# EAGLE design shield-st7735_1.8-spi-UNO-r4 (EAGLE 9.6.2)
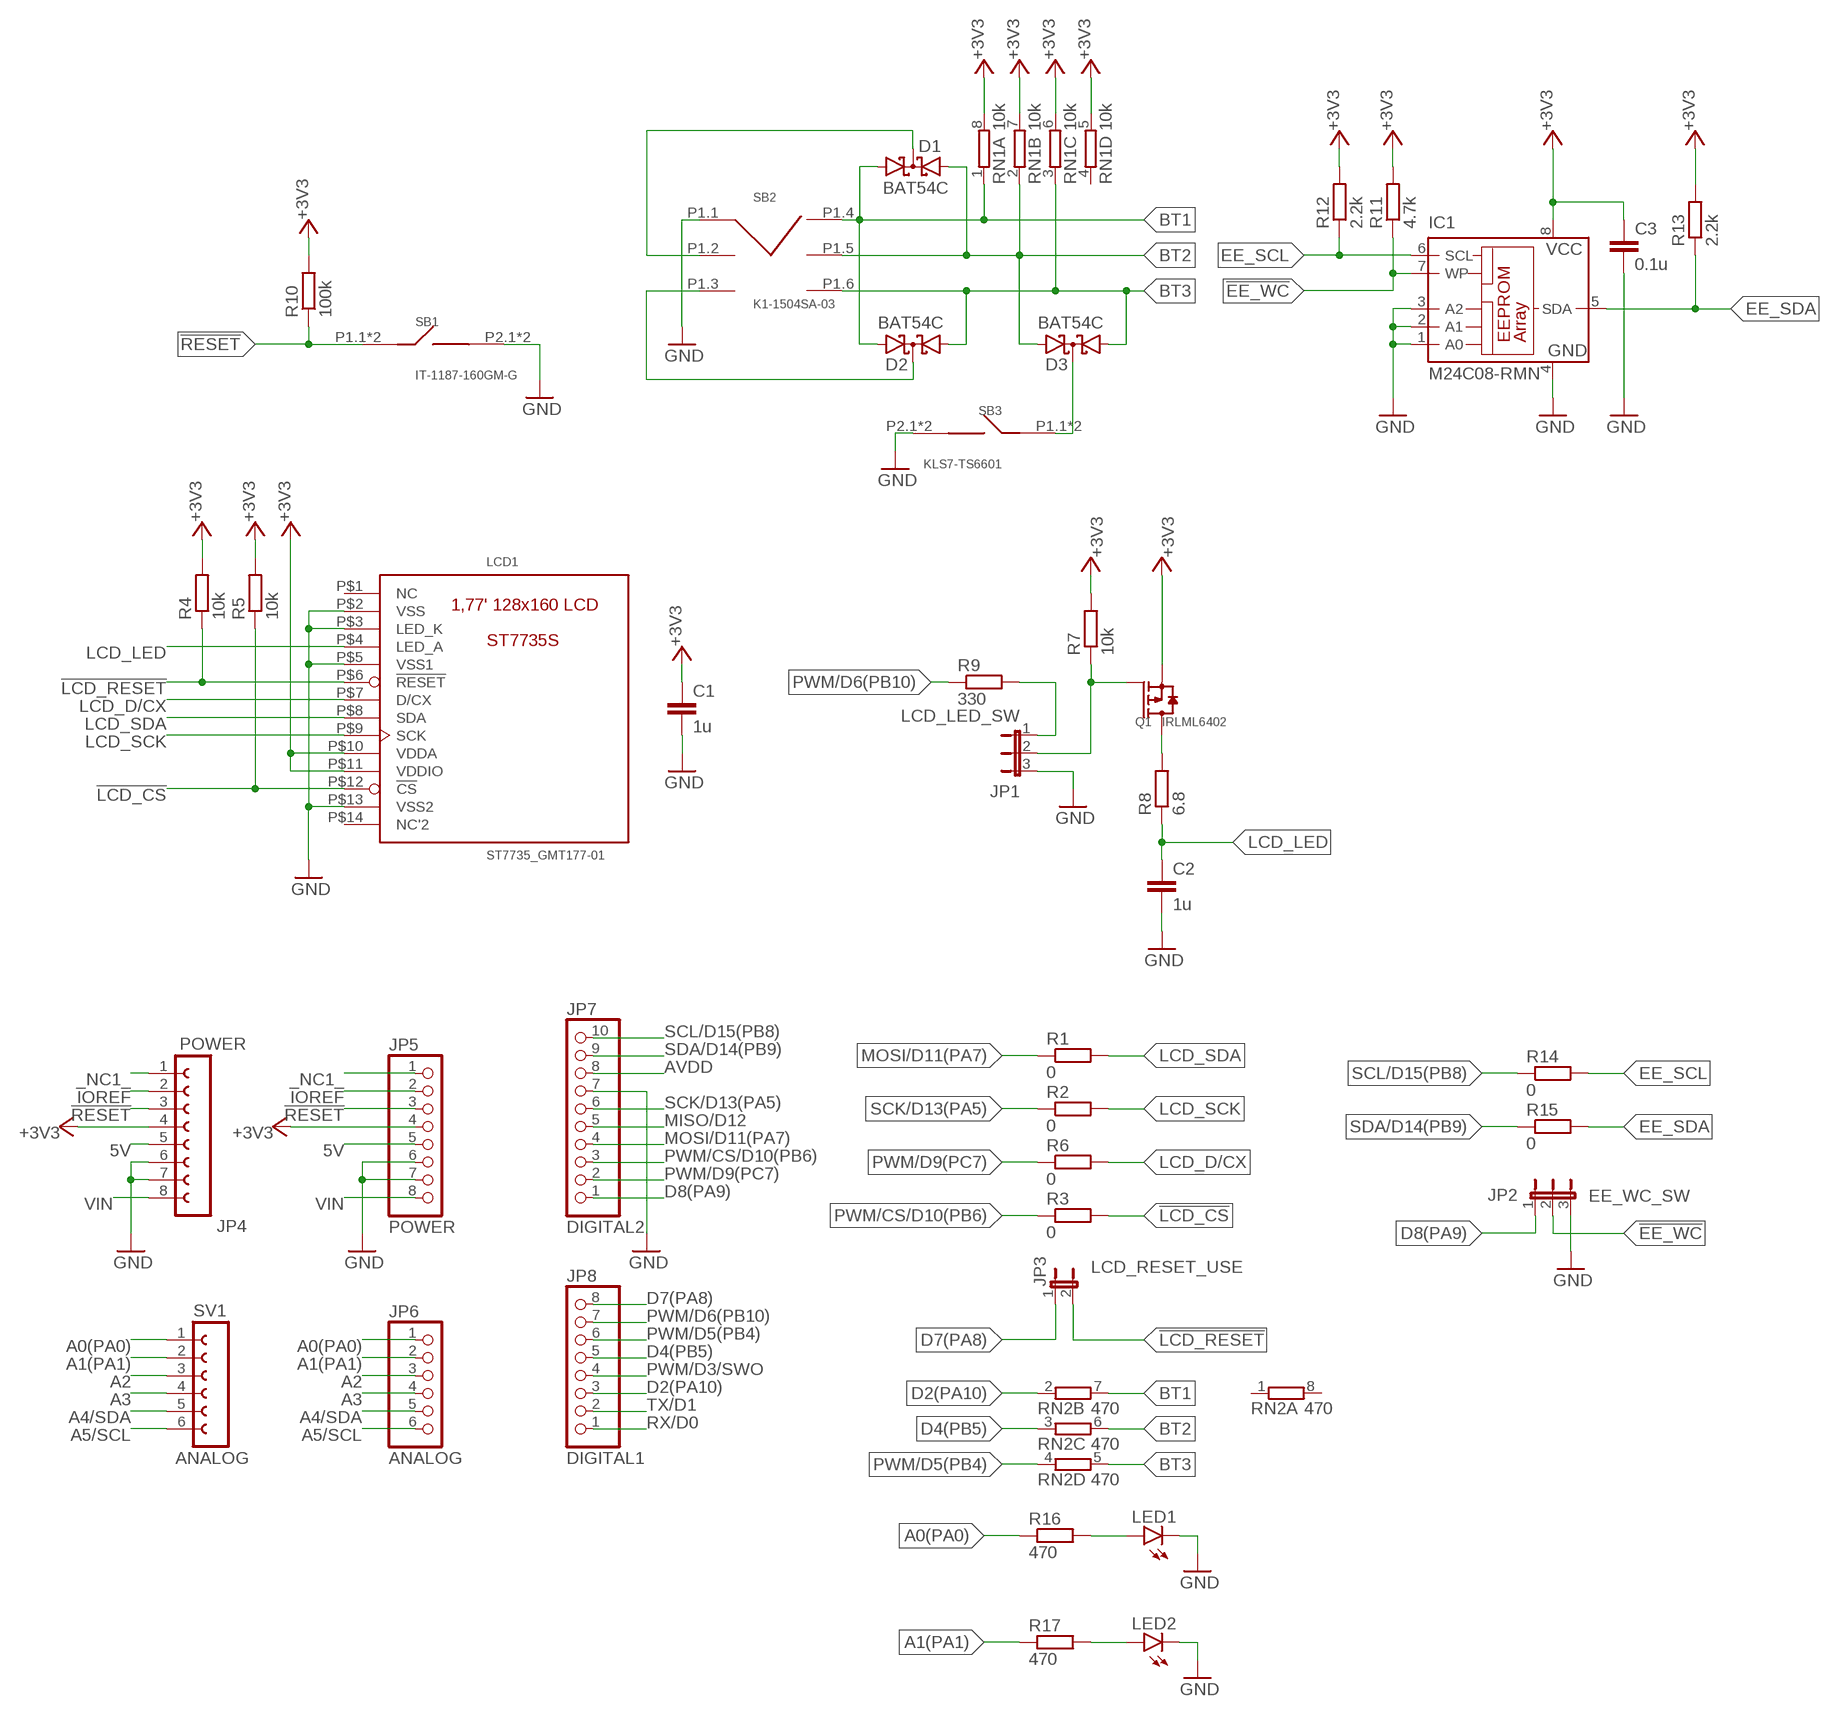
[diagram p0: schematic, sheet 1]

## Parts
C1  1u  C-EUC1206  [C1206]
C2  1u  C-EUC1206  [C1206]
C3  0.1u  C-EUC1206  [C1206]
D1  BAT54C  [SOT23]
D2  BAT54C  [SOT23]
D3  BAT54C  [SOT23]
IC1  M24C08-RMN  24LC08BSN  [SO-08]
JP1  LCD_LED_SW  JP2E  [JP2]
JP2  EE_WC_SW  JP2E  [JP2]
JP3  LCD_RESET_USE  JP1E  [JP1]
JP4  POWER  FE08-1  [FE08]
JP5  POWER  PINHD-1X8  [1X08]
JP6  ANALOG  PINHD-1X6  [1X06]
JP7  DIGITAL2  PINHD-1X10  [1X10]
JP8  DIGITAL1  PINHD-1X8  [1X08]
LCD1  ST7735_GMT177-01  [GMT177-01]
LED1  LEDCHIP-LED0805  [CHIP-LED0805]
LED2  LEDCHIP-LED0805  [CHIP-LED0805]
Q1  IRLML6402  [SOT23]
R1  0  R-EU_R1206  [R1206]
R2  0  R-EU_R1206  [R1206]
R3  0  R-EU_R1206  [R1206]
R4  10k  R-EU_R1206  [R1206]
R5  10k  R-EU_R1206  [R1206]
R6  0  R-EU_R1206  [R1206]
R7  10k  R-EU_R1206  [R1206]
R8  6.8  R-EU_R1206  [R1206]
R9  330  R-EU_R1206  [R1206]
R10  100k  R-EU_R1206  [R1206]
R11  4.7k  R-EU_R1206  [R1206]
R12  2.2k  R-EU_R1206  [R1206]
R13  2.2k  R-EU_R1206  [R1206]
R14  0  R-EU_R1206  [R1206]
R15  0  R-EU_R1206  [R1206]
R16  470  R-EU_R1206  [R1206]
R17  470  R-EU_R1206  [R1206]
RN1  10k  4R-NEXB38V  [EXB38V]
RN2  470  4R-NEXB38V  [EXB38V]
SB1  IT-1187-160GM-G  [IT-1187-160GM-G]
SB2  K1-1504SA-03  [K1-1504SA-3]
SB3  KLS7-TS6601  [KLS7-TS6601]
SV1  ANALOG  FE06-1  [FE06]

## Nets
5V [VDD]: JP4.5 JP5.5
!EE_WC!: IC1.7(WP) JP2.2 R11.1
!LCD_CS!: LCD1.P$12(!CS!) R3.2 R5.1
!LCD_RESET!: JP3.2 LCD1.P$6(!RESET!) R4.1
!RESET!: JP4.3 JP5.3 R10.1 SB1.P1.1(P1) SB1.P1.2(P1)
+3V3 [VDD]: C1.1 C3.1 IC1.8(VCC) JP4.4 JP5.4 LCD1.P$10(VDDA) LCD1.P$11(VDDIO) Q1.2(S) R4.2 R5.2 R7.2 R10.2 R11.2 R12.2 R13.2 RN1.5 RN1.6 RN1.7 RN1.8
_NC1_: JP4.1 JP5.1
A0(PA0): JP6.1 R16.1 SV1.1
A1(PA1): JP6.2 R17.1 SV1.2
A2: JP6.3 SV1.3
A3: JP6.4 SV1.4
A4/SDA: JP6.5 SV1.5
A5/SCL: JP6.6 SV1.6
AVDD: JP7.8
BT1: D1.1(A1) D2.2(A2) RN1.1 RN2.7 SB2.P1.4(P4)
BT2: D1.2(A2) D3.2(A2) RN1.2 RN2.6 SB2.P1.5(P5)
BT3: D2.1(A1) D3.1(A1) RN1.3 RN2.5 SB2.P1.6(P6)
D2(PA10): JP8.3 RN2.2
D4(PB5): JP8.5 RN2.3
D7(PA8): JP3.1 JP8.8
D8(PA9): JP2.1 JP7.1
EE_SCL: IC1.6(SCL) R12.1 R14.2
EE_SDA: IC1.5(SDA) R13.1 R15.2
GND [GND]: C1.2 C2.2 C3.2 IC1.1(A0) IC1.2(A1) IC1.3(A2) IC1.4(GND) JP1.3 JP2.3 JP4.6 JP4.7 JP5.6 JP5.7 JP7.7 LCD1.P$2(VSS) LCD1.P$3(LED_K) LCD1.P$5(VSS1) LCD1.P$13(VSS2) LED1.C LED2.C SB1.P2.1(P2) SB1.P2.2(P2) SB2.P1.1(P1) SB3.P2.1(P2) SB3.P2.2(P2)
IOREF: JP4.2 JP5.2
LCD_D/CX: LCD1.P$7(D/CX) R6.2
LCD_LED: C2.1 LCD1.P$4(LED_A) R8.1
LCD_SCK: LCD1.P$9(SCK) R2.2
LCD_SDA: LCD1.P$8(SDA) R1.2
MISO/D12: JP7.5
MOSI/D11(PA7): JP7.4 R1.1
N$1: JP1.2 Q1.1(G) R7.1
N$2: Q1.3(D) R8.2
N$3: D2.3(CC) SB2.P1.3(P3)
N$4: JP1.1 R9.2
N$5: D1.3(CC) SB2.P1.2(P2)
N$6: D3.3(CC) SB3.P1.1(P1) SB3.P1.2(P1)
N$7: LED2.A R17.2
N$8: LED1.A R16.2
PWM/CS/D10(PB6): JP7.3 R3.1
PWM/D3/SWO: JP8.4
PWM/D5(PB4): JP8.6 RN2.4
PWM/D6(PB10): JP8.7 R9.1
PWM/D9(PC7): JP7.2 R6.1
RX/D0: JP8.1
SCK/D13(PA5): JP7.6 R2.1
SCL/D15(PB8): JP7.10 R14.1
SDA/D14(PB9): JP7.9 R15.1
TX/D1: JP8.2
VIN [VDD]: JP4.8 JP5.8
Unconnected: LCD1.P$1(NC) LCD1.P$14(NC'2) RN1.4 RN2.1 RN2.8

## Library data of the parts
C1-C3 = rcl:C-EU: CAPACITOR, European symbol; SPICEPREFIX: C
D1-D3 = diode:BAT54C: Schottky Diodes Source: Fairchild .. BAT54.pdf
IC1 = microchip:24*: Serial EEPROM I2C; MPN: 24LC08B/SN; OC_FARNELL: 1212669; OC_NEWARK: 12C2005
JP1 JP2 = jumper:JP2E: JUMPER
JP3 = jumper:JP1E: JUMPER
JP4 = con-lsta:FE08-1: FEMALE HEADER; OC_FARNELL: unknown; OC_NEWARK: unknown
JP5 JP8 = pinhead:PINHD-1X8: PIN HEADER
JP6 = pinhead:PINHD-1X6: PIN HEADER
JP7 = pinhead:PINHD-1X10: PIN HEADER
LCD1 = other_lcd:ST7735_GMT177-01: 1,77'' LCD Module Resolution: 128x160 Color: RGB (565) Controller: ST7735S
LED1 LED2 = led:LED: LED OSRAM: - CHIPLED LG R971, LG N971, LY N971, LG Q971, LY Q971, LO R971, LY R971 LH N974, LH R974 LS Q976, LO Q976, LY Q976 LO Q996 - Hyper CHIPLED LW Q18S LB Q993, LB Q99A, LB R99A - SideLED LS A670, LO A670, LY A670, LG A670, LP A670 LB A673, LV A673, LT A673, LW A673 LH A674 LY A675 LS A676, LA A676, LO A676, LY A676, LW A676 LS A679, LY A679, LG A679 - Hyper Micro SIDELED® LS Y876, LA Y876, LO Y876, LY Y876 LT Y87S - SmartLED LW L88C, LW L88S LB L89C, LB L89S, LG L890 LS L89K, LO L89K, LY L89K LS L896, LA L896, LO L896, LY L896 - TOPLED LS T670, LO T670, LY T670, LG T670, LP T670 LSG T670, LSP T670, LSY T670, LOP T670, LYG T670 LG T671, LOG T671, LSG T671 LB T673, LV T673, LT T673, LW T673 LH T674 LS T676, LA T676, LO T676, LY T676, LB T676, LH T676, LSB T676, LW T676 LB T67C, LV T67C, LT T67C, LS T67K, LO T67K, LY T67K, LW E67C LS E67B, LA E67B, LO E67B, LY E67B, LB E67C, LV E67C, LT E67C LW T67C LS T679, LY T679, LG T679 LS T770, LO T770, LY T770, LG T770, LP T770 LB T773, LV T773, LT T773, LW T773 LH T774 LS E675, LA E675, LY E675, LS T675 LS T776, LA T776, LO T776, LY T776, LB T776 LHGB T686 LT T68C, LB T68C - Hyper Mini TOPLED® LB M676 - Mini TOPLED Santana® LG M470 LS M47K, LO M47K, LY M47K Source: http://www.osram.convergy.de LUXEON: - LUMILED® LXK2-PW12-R00, LXK2-PW12-S00, LXK2-PW14-U00, LXK2-PW14-V00 LXK2-PM12-R00, LXK2-PM12-S00, LXK2-PM14-U00 LXK2-PE12-Q00, LXK2-PE12-R00, LXK2-PE12-S00, LXK2-PE14-T00, LXK2-PE14-U00 LXK2-PB12-K00, LXK2-PB12-L00, LXK2-PB12-M00, LXK2-PB14-N00, LXK2-PB14-P00, LXK2-PB14-Q00 LXK2-PR12-L00, LXK2-PR12-M00, LXK2-PR14-Q00, LXK2-PR14-R00 LXK2-PD12-Q00, LXK2-PD12-R00, LXK2-PD12-S00 LXK2-PH12-R00, LXK2-PH12-S00 LXK2-PL12-P00, LXK2-PL12-Q00, LXK2-PL12-R00 Source: www.luxeon.com KINGBRIGHT: KA-3528ASYC Source: www.kingbright.com
Q1 = other_transistor:IRLML6402: IRLML6402 HEXFET® Power P-Channel MOSFET VDSS = -20V RDS(on) = 0.065Ω @ Vgs = -4.5 V RDS(on) = 0.135Ω @ Vgs = -2.5 V
R1-R17 = rcl:R-EU_: RESISTOR, European symbol; SPICEPREFIX: R
RN1 RN2 = resistor-dil:4R-N: Array Chip Resistor Source: RS Component / Phycomp; OC_FARNELL: unknown; OC_NEWARK: unknown
SB1 = other_button:IT-1187-160GM-G: Tact Switch Specification Rating: 50mA 12V DC Max. Circuit: 1P1T Function: OFF-(ON) Opearting force: 160±50g Contact Resistance: 100mΩ Max. (Initial) Travel: 0.25±0.1mm Life: 100,000 Cycles Min. Minimum load: 10mA 3.3V DC (reference only) Soldering Temperature: 250°C Max, for 3 sec. Soldering time: 1 time only Note: Unwashable, don't be immerged by epoxy and organic solvent.
SB2 = other_button:K1-1504SA-03: 5-way Tactile Switch
SB3 = other_button:KLS7-TS6601: Кнопка тактовая без заземления 6x6 мм.
SV1 = con-lsta:FE06-1: FEMALE HEADER; OC_FARNELL: unknown; OC_NEWARK: unknown

## Net classes
0 default: width 0.3 mm, drill 0.3 mm, clearance 0.2 mm
1 GND: width 0.5 mm, drill 0.5 mm, clearance 0.2 mm
2 VDD: width 0.5 mm, drill 0.5 mm, clearance 0.2 mm

## Board
Shield for STM32 Nucleo-64 LCD 1.8' ST7735 with SPI
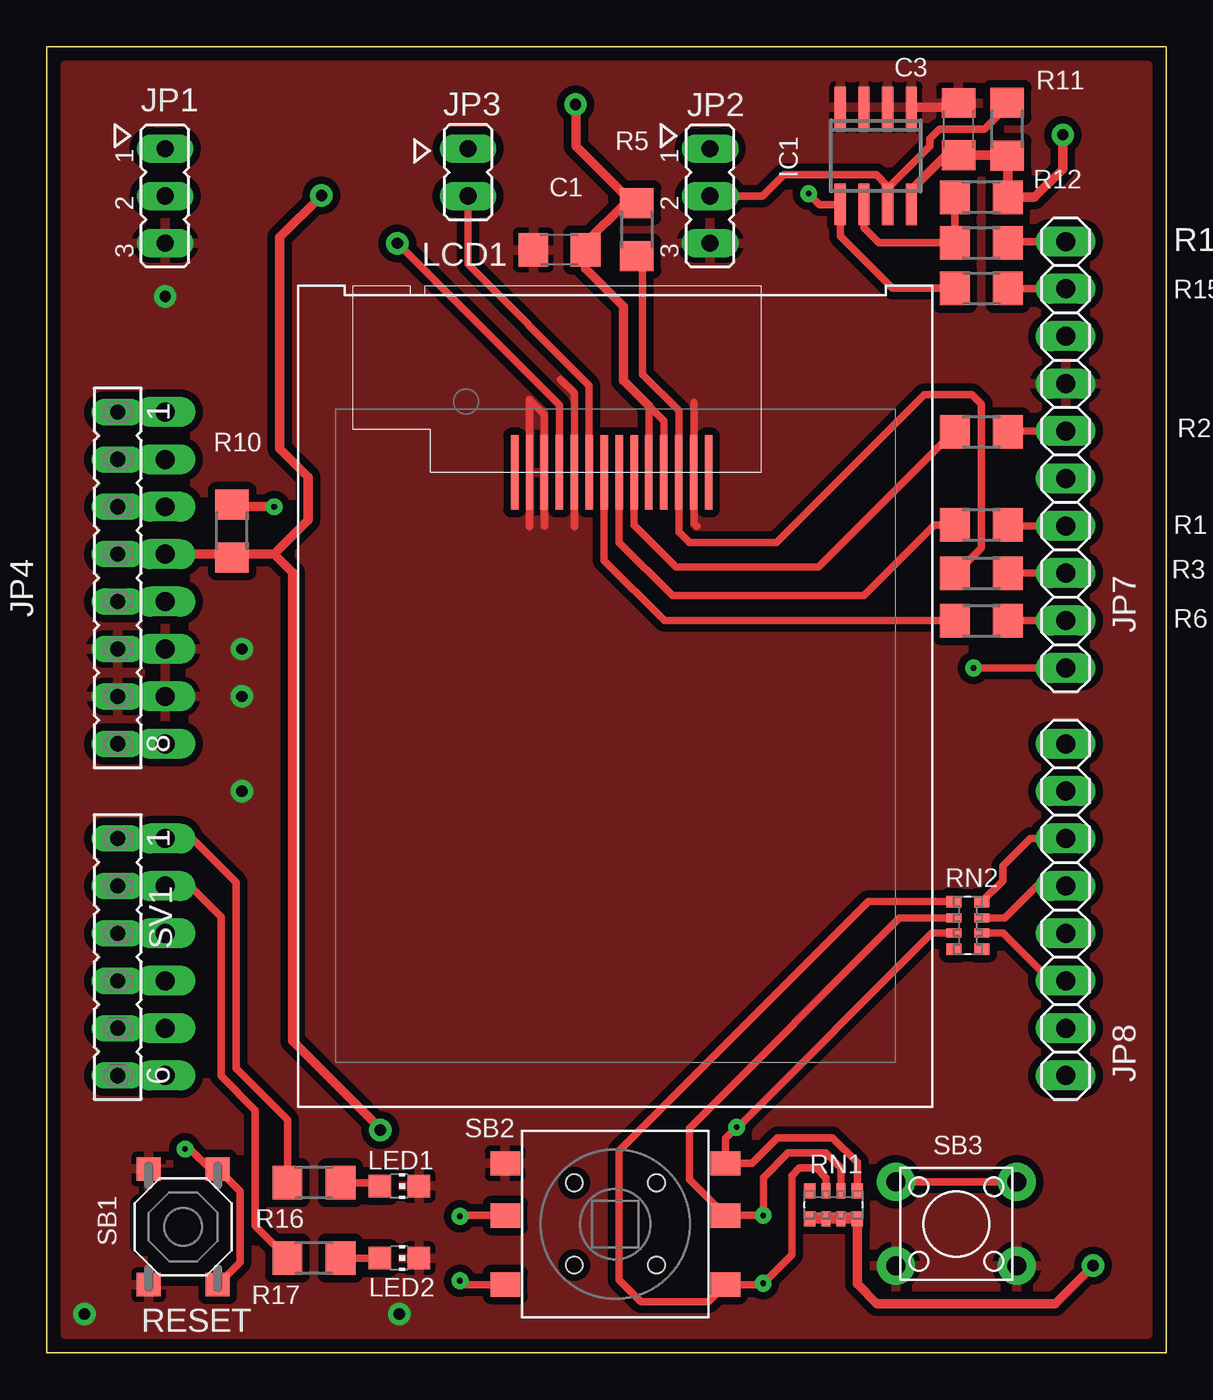
[diagram p1: board, top side]
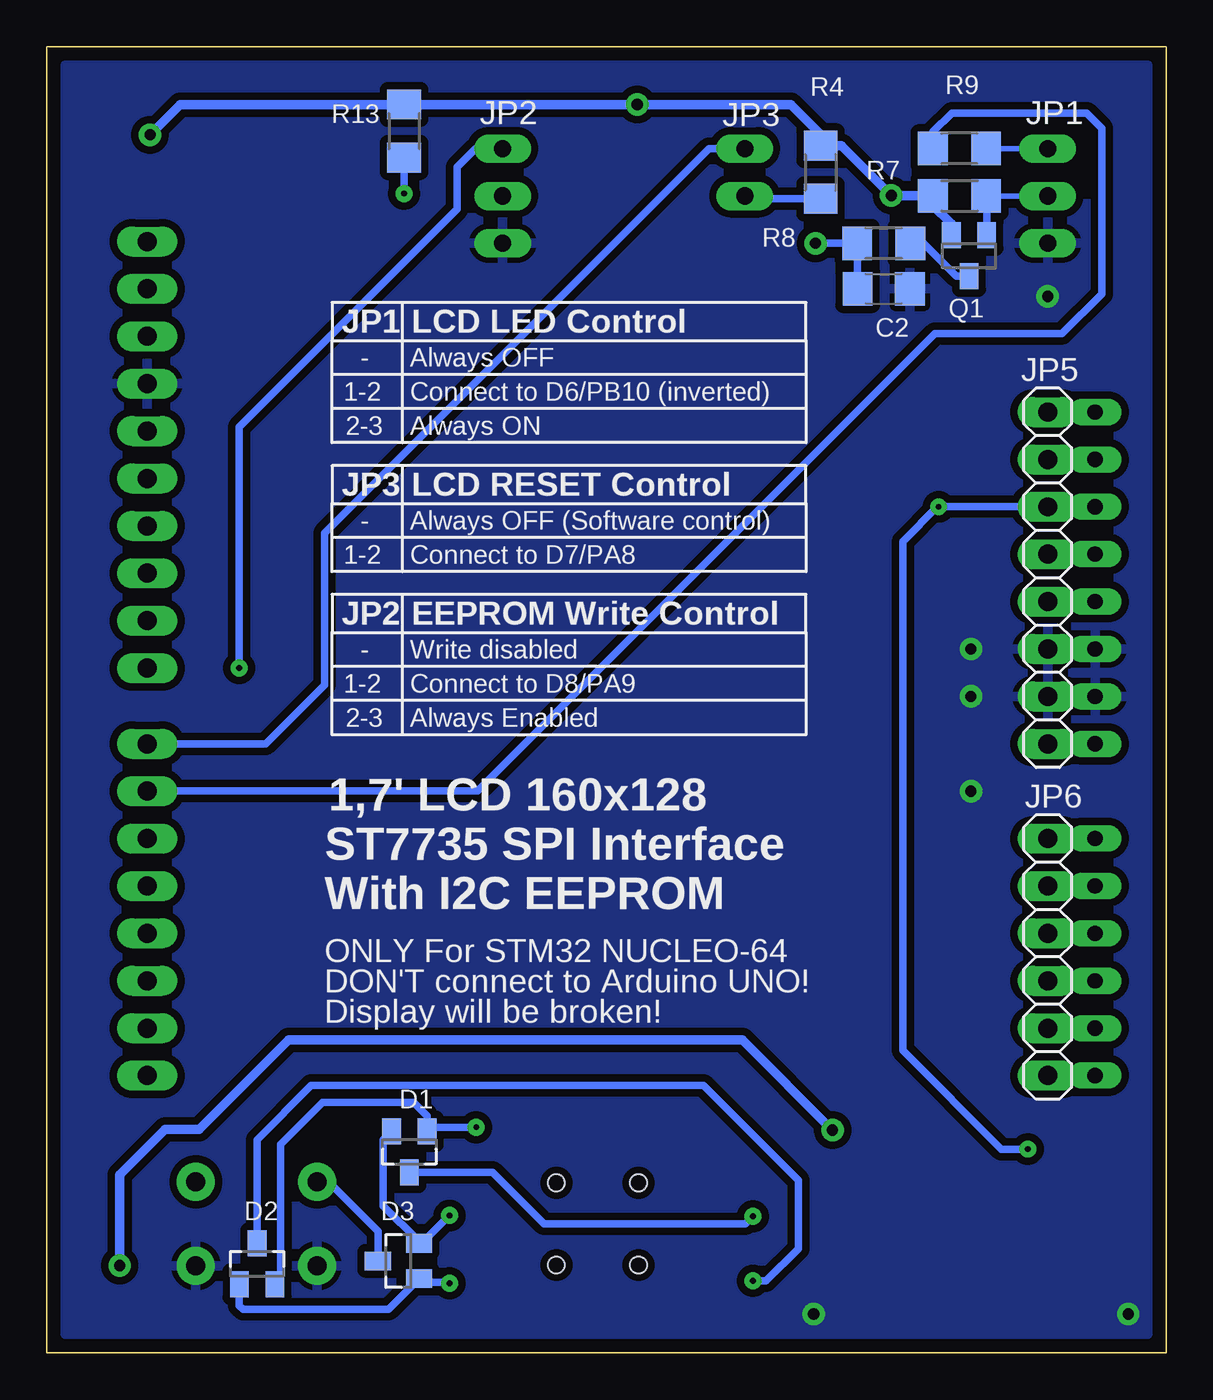
[diagram p2: board, bottom side, seen from below]

Size 60 x 70 mm. Coordinates in mm from the lower left corner, seen from the top.
Outline: 0,0 60,0 60,70 0,70 0,0
Copper layers (1*16): Top 0.035mm / dielectric 1.6mm / Bottom 0.035mm
Design rules "jlcpcb_weak": minimum track width 0.2mm, minimum drill 0.3mm, track to track 0.2mm, track to pad 0.2mm, pad to pad 0.2mm, via to via 0.2mm, smd to smd 6mil, copper to edge 0.4mm, drill to drill 0.5mm, minimum pad ring 0.3mm, minimum via ring 0.3mm, stop-mask expansion 4mil, vias tented up to drill 0.45mm, thermal gap 0.3mm
tRestrict: area 5.1,5.8 to 8.7,7.9

### Footprints (pad centres in the part's own frame; a part is rotated, then mirrored left to right if it is on the bottom)
C1206 = smd 1.6 x 1.8: 1 -1.4,0; 2 1.4,0
SOT23 = smd 1 x 1.4: 1 -0.95,-1.1; 2 0.95,-1.1; 3 0,1.1
SO-08 = smd 0.6 x 2.2: 1 -1.905,-2.6; 2 -0.635,-2.6; 3 0.635,-2.6; 4 1.905,-2.6; 5 1.905,2.6; 6 0.635,2.6; 7 -0.635,2.6; 8 -1.905,2.6
JP2 = drill 0.914 long: 1 -2.54,0; 2 0,0; 3 2.54,0
JP1 = drill 0.914 long: 1 0,-1.27; 2 0,1.27
FE08 = drill 0.813 long: 1 -8.89,0; 2 -6.35,0; 3 -3.81,0; 4 -1.27,0; 5 1.27,0; 6 3.81,0; 7 6.35,0; 8 8.89,0
1X08 = drill 1.016 long: 1 -8.89,0; 2 -6.35,0; 3 -3.81,0; 4 -1.27,0; 5 1.27,0; 6 3.81,0; 7 6.35,0; 8 8.89,0
1X06 = drill 1.016 long: 1 -6.35,0; 2 -3.81,0; 3 -1.27,0; 4 1.27,0; 5 3.81,0; 6 6.35,0
1X10 = drill 1.016 long: 1 -11.43,0; 2 -8.89,0; 3 -6.35,0; 4 -3.81,0; 5 -1.27,0; 6 1.27,0; 7 3.81,0; 8 6.35,0; 9 8.89,0; 10 11.43,0
GMT177-01 = smd 0.4 x 4: P$1 -5.4,12; P$2 -4.6,12; P$3 -3.8,12; P$4 -3,12; P$5 -2.2,12; P$6 -1.4,12; P$7 -0.6,12; P$8 0.2,12; P$9 1,12; P$10 1.8,12; P$11 2.6,12; P$12 3.4,12; P$13 4.2,12; P$14 5,12
CHIP-LED0805 = smd 1.2 x 1.2: A 0,-1.05; C 0,1.05
R1206 = smd 1.6 x 1.803: 1 -1.422,0; 2 1.422,0
EXB38V = smd 0.6 x 0.8: 1 -1.275,-0.75; 4 1.275,-0.75; 5 1.275,0.75; 8 -1.275,0.75 | smd 0.5 x 0.8: 2 -0.4,-0.75; 3 0.4,-0.75; 6 0.4,0.75; 7 -0.4,0.75
IT-1187-160GM-G = smd 1.27 x 1.27: P1.1 -1.85,3.1; P1.2 -1.85,-3.1; P2.1 1.85,3.1; P2.2 1.85,-3.1
K1-1504SA-3 = smd 1.6 x 1.3: P1.1 -5.9,3.25; P1.2 -5.9,0.45; P1.3 -5.9,-3.25; P1.4 5.9,3.25; P1.5 5.9,0.45; P1.6 5.9,-3.25 | hole 0.9: 2.2,2.2; -2.2,2.2; -2.2,-2.2; 2.2,-2.2
KLS7-TS6601 = drill 1.016 pad 2.032: P1.1 -3.25,2.25; P1.2 3.25,2.25; P2.1 -3.25,-2.25; P2.2 3.25,-2.25
FE06 = drill 0.813 long: 1 -6.35,0; 2 -3.81,0; 3 -1.27,0; 4 1.27,0; 5 3.81,0; 6 6.35,0

### Placement (x,y rotation side)
C1  27.48,59.11 180 top
C2  15.14,57.02 0 bottom
C3  48.87,65.58 90 top
D1  40.56,10.77 180 bottom
D2  48.72,4.78 0 bottom
D3  41.15,4.92 90 bottom
IC1  44.43,64.14 180 top
JP1  6.35,62 270 top
JP2  35.56,62 270 top
JP3  22.59,63.27 180 top
JP4  3.81,41.53 270 top
JP5  6.35,41.53 270 bottom
JP6  6.35,21.21 270 bottom
JP7  54.61,48.13 90 top
JP8  54.61,23.75 90 top
LCD1  30.48,35.18 0 top
LED1  18.9,8.94 270 top
LED2  18.9,5.08 270 top
Q1  10.57,58.79 180 bottom
R1  50.09,44.37 180 top
R2  50.09,49.35 180 top
R3  50.09,41.78 180 top
R4  18.52,63.27 90 bottom
R5  31.63,60.2 90 top
R6  50.09,39.24 180 top
R7  11.07,62 180 bottom
R8  15.14,59.46 0 bottom
R9  11.07,64.54 0 bottom
R10  9.94,44.04 270 top
R11  51.48,65.58 270 top
R12  50.09,61.92 0 top
R13  40.84,65.48 90 bottom
R14  50.09,59.48 180 top
R15  50.09,57.05 180 top
R16  14.33,9.12 0 top
R17  14.33,5.08 0 top
RN1  42.16,7.92 180 top
RN2  49.38,22.91 90 top
SB1  7.32,6.75 180 top
SB2  30.48,6.91 0 top
SB3  48.75,6.91 0 top
SV1  3.81,21.21 270 top

### Tracks (layer width: path | path; a pad name or v marks a point on that pad's centre or on a via)
5V
  Top 0.5: JP4.5 JP5.5
!EE_WC!
  Top 0.4: R11.1 51.48,66.8 50.26,65.58 47.85,65.58 47.35,65.07 47.35,64.67 45.07,62.39 IC1.7 45.07,62.53 44.46,63.14 39.51,63.14 38.37,62 JP2.2
!LCD_CS!
  Top 0.4: R5.1 31.93,58.47 31.93,52.44 33.88,50.49 LCD1.P$12 33.88,43.99 34.44,43.43 39.12,43.43 47.04,51.36 49.58,51.36 50.09,50.85 50.09,43.13 48.75,41.78 R3.2
!LCD_RESET!
  Top 0.4: LCD1.P$6 29.08,51.84 22.59,58.33 JP3.2
  Bottom 0.4: R4.1 22.43,61.85 JP3.2
!RESET!  (via drill 0.3)
  Top 0.4: SB1.P1.1 10.36,4.85 10.36,8.66 SB1.P1.2 8.76,9.85 7.69,10.92 v7.42,10.92
  Top 0.5: v12.19,45.34 10.06,45.34 R10.1 | JP4.3 JP5.3
  Bottom 0.4: JP4.3 v12.19,45.34 12.27,45.34 14.12,43.48 14.12,16.2 8.84,10.92 v7.42,10.92
+3V3  (via drill 0.6)
  Top 0.4: LCD1.P$10 32.28,50.75 33.08,49.95 LCD1.P$11
  Top 0.5: RN1.5 RN1.6 RN1.7 RN1.8 43.44,3.7 44.5,2.64 54.05,2.64 v56.08,4.67 | v14.73,62.02 12.5,59.79 12.5,48.46 14.02,46.94 14.02,44.63 12.19,42.8 | IC1.8 46.34,62.34 48.18,64.18 C3.1 51.46,64.18 R11.2 51.51,64.13 R12.2 52.93,61.92 54.46,63.45 v54.46,65.28 | v28.35,66.9 28.38,66.87 28.38,64.67 31.22,61.82 31.02,61.62 | R5.2 31.02,61.62 | 31.02,61.62 28.88,59.48 C1.1 28.88,58.09 30.91,56.06 30.91,52.11 32.28,50.75 | v17.88,11.94 17.88,12.04 13.19,16.73 13.19,41.81 12.19,42.8 | 10.12,42.8 R10.2 | JP4.4 JP5.4 10.12,42.8 | 10.12,42.8 12.19,42.8
  Bottom 0.5: Q1.2 11.52,60.5 12.5,61.48 R7.2 12.52,62.02 v14.73,62.02 17.4,64.69 R4.2 18.52,65.3 20.12,66.9 v28.35,66.9 R13.2 | R13.2 52.83,66.9 v54.46,65.28 | R13.2 | v17.88,11.94 22.71,16.76 47.04,16.76 51.82,11.99 53.65,11.99 56.08,9.55 v56.08,4.67
_NC1_
  Top 0.4: JP4.1 JP5.1
A0(PA0)
  Top 0.4: JP6.1 7.8,27.56 10.16,25.2 10.16,15.24 12.9,12.5 R16.1
  Top 0.5: SV1.1 JP6.1
A1(PA1)
  Top 0.4: R17.1 11.18,6.81 11.18,13.01 9.35,14.83 9.35,23.37 7.7,25.02 JP6.2
  Top 0.5: SV1.2 JP6.2
A2
  Top 0.5: SV1.3 JP6.3
A3
  Top 0.5: SV1.4 JP6.4
A4/SDA
  Top 0.5: SV1.5 JP6.5
A5/SCL
  Top 0.5: SV1.6 JP6.6
BT1  (via drill 0.3)
  Top 0.4: RN1.1 43.44,10.2 42.11,11.53 39.17,11.53 37.8,10.16 SB2.P1.4 36.38,11.49 v36.98,12.09 37.04,12.09 47.45,22.51 RN2.7
  Bottom 0.4: v36.98,12.09 39.39,12.09 D1.1 39.61,12.69 40.34,13.41 45.21,13.41 47.45,11.18 47.45,4 D2.2
BT2  (via drill 0.3)
  Top 0.4: RN1.2 42.56,9.91 41.76,10.72 39.74,10.72 38.41,9.38 v38.41,7.36 v38.4,7.36 SB2.P1.5 34.44,9.3 34.44,12.04 45.71,23.31 RN2.6
  Bottom 0.4: D1.2 41.96,11.42 41.96,7.89 40.05,5.98 D3.2 39.89,5.88 v38.41,7.36
BT3  (via drill 0.3)
  Top 0.4: RN1.3 41.76,9.39 41.25,9.9 40.34,9.9 39.93,9.5 39.93,5.25 v38.41,3.73 38.34,3.66 SB2.P1.6 35.47,2.74 31.85,2.74 30.68,3.91 30.68,10.82 44.05,24.18 RN2.5
  Bottom 0.4: v38.41,3.73 38.45,3.77 39.84,3.77 D3.1 41.69,2.34 49.48,2.34 49.67,2.53 D2.1
D2(PA10)
  Top 0.4: RN2.2 51.25,22.51 53.82,19.94 JP8.3
D4(PB5)
  Top 0.4: RN2.3 51.35,23.31 53.06,25.02 JP8.5
D7(PA8)
  Bottom 0.4: JP3.1 24.51,64.54 45.11,43.94 45.11,35.79 48.26,32.64 JP8.8
D8(PA9)  (via drill 0.3)
  Top 0.4: v49.68,36.7 JP7.1
  Bottom 0.4: v49.68,36.7 49.68,49.6 38,61.29 38,63.55 37.01,64.54 JP2.1
EE_SCL
  Top 0.4: IC1.6 43.8,60.29 44.6,59.48 R14.2 R12.1
EE_SDA  (via drill 0.3)
  Top 0.4: R15.2 45.31,57.05 42.53,59.83 IC1.5 41.42,61.54 v40.84,62.13
  Bottom 0.4: R13.1 v40.84,62.13
GND  (via drill 0.6)
  Top 0.4: 27.53,52.17 28.28,51.42 LCD1.P$5 28.28,44.28 | 25.88,44.27 LCD1.P$2 25.88,51.08 26.68,50.28 LCD1.P$3 26.68,44.3 | 34.68,50.94 LCD1.P$13 34.68,44.47 34.85,44.3
  Top 0.5: IC1.1 48.63,66.74 C3.2
  other vias: 18.9,2.08 10.46,37.72 10.46,35.18 6.35,56.62 10.46,30.1 2.03,2.08
  pour Bottom (isolate 0.4): 1,1 59,1 59,69 1,69
  pour Top (isolate 0.4): 1,69 59,69 59,1 1,1
IOREF
  Top 0.4: JP4.2 JP5.2
LCD_D/CX
  Top 0.4: R6.2 33.1,39.24 29.88,42.46 LCD1.P$7
LCD_LED  (via drill 0.6)
  Top 0.4: LCD1.P$4 27.48,50.78 v18.8,59.46
  Bottom 0.4: C2.1 16.56,57.05 R8.1 v18.8,59.46
LCD_SCK
  Top 0.4: LCD1.P$9 31.48,44.36 33.73,42.11 41.35,42.11 48.59,49.35 R2.2
LCD_SDA
  Top 0.4: R1.2 47.58,44.38 43.79,40.59 33.53,40.59 30.68,43.43 LCD1.P$8
MOSI/D11(PA7)
  Top 0.4: R1.1 51.57,44.32 JP7.4
N$1
  Bottom 0.3: R7.1 JP1.2
  Bottom 0.4: Q1.1 9.62,61.96 R7.1
N$2
  Bottom 0.4: Q1.3 11.24,57.69 13.01,59.46 R8.2
N$3  (via drill 0.3)
  Top 0.4: SB2.P1.3 22.35,3.66 v22.15,3.86
  Bottom 0.4: v22.15,3.86 21.44,3.86 19.71,5.59 19.71,9.25 24.79,14.33 45.82,14.33 48.72,11.43 D2.3
N$4
  Bottom 0.3: R9.2 JP1.1
N$5  (via drill 0.3)
  Top 0.4: SB2.P1.2 22.19,7.36 v22.15,7.32
  Bottom 0.4: v22.15,7.32 22.55,6.91 33.33,6.91 36.09,9.67 D1.3
N$6
  Top 0.4: SB3.P1.1 SB3.P1.2
  Bottom 0.4: D3.3 42.25,6.51 44.89,9.16 SB3.P1.1
N$7
  Top 0.4: R17.2 LED2.A
N$8
  Top 0.4: R16.2 17.67,9.12 LED1.A
PWM/CS/D10(PB6)
  Top 0.4: R3.1 JP7.3
PWM/D5(PB4)
  Top 0.4: JP8.6 52.71,27.56 51.23,26.08 51.23,25.29 RN2.4
PWM/D6(PB10)
  Bottom 0.4: R9.1 12.5,65.43 11.48,66.45 4.27,66.45 3.45,65.63 3.45,56.74 5.59,54.61 12.39,54.61 36.9,30.1 JP8.7
PWM/D9(PC7)
  Top 0.4: JP7.2 R6.1
SCK/D13(PA5)
  Top 0.4: R2.1 51.56,49.4 JP7.6
SCL/D15(PB8)
  Top 0.4: JP7.10 51.59,59.56 R14.1
SDA/D14(PB9)
  Top 0.4: JP7.9 51.54,57.02 R15.1
VIN
  Top 0.5: JP5.8 JP4.8

### Text on the board
tNames: RESET
bNames: JP1 | JP3 | JP2 | LCD LED Control | JP1 | Always OFF | - | Connect to D6/PB10 (inverted) | 1-2 | Always ON | 2-3 | LCD RESET Control | JP3 | Always OFF (Software control) | - | Connect to D7/PA8 | 1-2 | EEPROM Write Control | JP2 | Write disabled | - | Connect to D8/PA9 | 1-2 | Always Enabled | 2-3 | 1,7' LCD 160x128 | ST7735 SPI Interface | With I2C EEPROM | ONLY For STM32 NUCLEO-64 | DON'T connect to Arduino UNO! | Display will be broken!